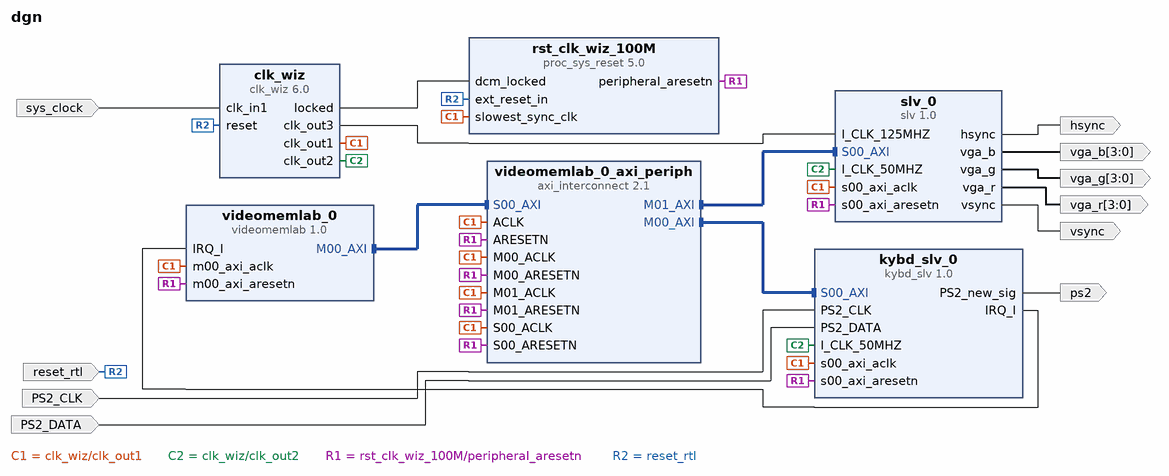
[diagram p0: block diagram of the top level]
# Vivado block design dgn, xc7z010clg400-1, Vivado 2019.2
create_bd_design dgn

create_bd_port -dir O vsync
create_bd_port -dir O hsync
create_bd_port -dir O -from 3 -to 0 vga_r
create_bd_port -dir O -from 3 -to 0 vga_g
create_bd_port -dir O -from 3 -to 0 vga_b
create_bd_port -dir O ps2
create_bd_port -dir I PS2_CLK
create_bd_port -dir I PS2_DATA
create_bd_port -dir I -type clk sys_clock
set_property -dict {CONFIG.FREQ_HZ 125000000} [get_bd_ports sys_clock]
create_bd_port -dir I -type rst reset_rtl
set_property -dict {CONFIG.POLARITY ACTIVE_HIGH} [get_bd_ports reset_rtl]

create_bd_cell -type ip -vlnv clarkson.edu:user:slv:1.0 slv_0
create_bd_cell -type ip -vlnv xilinx.com:ip:clk_wiz:6.0 clk_wiz
set_property -dict [list \
  CONFIG.CLKIN1_JITTER_PS 80.0 \
  CONFIG.CLKOUT1_JITTER 124.615 \
  CONFIG.CLKOUT1_PHASE_ERROR 96.948 \
  CONFIG.CLKOUT2_JITTER 143.688 \
  CONFIG.CLKOUT2_PHASE_ERROR 96.948 \
  CONFIG.CLKOUT2_REQUESTED_OUT_FREQ 50.000 \
  CONFIG.CLKOUT2_USED true \
  CONFIG.CLKOUT3_JITTER 119.348 \
  CONFIG.CLKOUT3_PHASE_ERROR 96.948 \
  CONFIG.CLKOUT3_REQUESTED_OUT_FREQ 125.000 \
  CONFIG.CLKOUT3_USED true \
  CONFIG.MMCM_CLKFBOUT_MULT_F 8.000 \
  CONFIG.MMCM_CLKIN1_PERIOD 8.000 \
  CONFIG.MMCM_CLKOUT1_DIVIDE 20 \
  CONFIG.MMCM_CLKOUT2_DIVIDE 8 \
  CONFIG.NUM_OUT_CLKS 3 \
  CONFIG.PRIM_IN_FREQ 125.000 \
] [get_bd_cells clk_wiz]
create_bd_cell -type ip -vlnv xilinx.com:ip:axi_interconnect:2.1 videomemlab_0_axi_periph
set_property -dict {CONFIG.NUM_MI 2} [get_bd_cells videomemlab_0_axi_periph]
create_bd_cell -type ip -vlnv xilinx.com:ip:proc_sys_reset:5.0 rst_clk_wiz_100M
set_property -dict {CONFIG.C_EXT_RST_WIDTH 1} [get_bd_cells rst_clk_wiz_100M]
create_bd_cell -type ip -vlnv clarkson.edu:user:kybd_slv:1.0 kybd_slv_0
create_bd_cell -type ip -vlnv clarkson.edu:user:videomemlab:1.0 videomemlab_0

# ---- connections ----

connect_bd_intf_net [get_bd_intf_pins videomemlab_0/M00_AXI] [get_bd_intf_pins videomemlab_0_axi_periph/S00_AXI]
connect_bd_intf_net [get_bd_intf_pins videomemlab_0_axi_periph/M00_AXI] [get_bd_intf_pins kybd_slv_0/S00_AXI]
connect_bd_intf_net [get_bd_intf_pins videomemlab_0_axi_periph/M01_AXI] [get_bd_intf_pins slv_0/S00_AXI]
connect_bd_net [get_bd_pins kybd_slv_0/PS2_new_sig] [get_bd_ports ps2]
connect_bd_net [get_bd_pins kybd_slv_0/IRQ_I] [get_bd_pins videomemlab_0/IRQ_I]
connect_bd_net [get_bd_pins clk_wiz/clk_out1] \
  [get_bd_pins slv_0/s00_axi_aclk] [get_bd_pins videomemlab_0_axi_periph/ACLK] \
  [get_bd_pins videomemlab_0_axi_periph/S00_ACLK] [get_bd_pins rst_clk_wiz_100M/slowest_sync_clk] \
  [get_bd_pins videomemlab_0_axi_periph/M00_ACLK] [get_bd_pins videomemlab_0_axi_periph/M01_ACLK] \
  [get_bd_pins kybd_slv_0/s00_axi_aclk] [get_bd_pins videomemlab_0/m00_axi_aclk]
connect_bd_net [get_bd_ports sys_clock] [get_bd_pins clk_wiz/clk_in1]
connect_bd_net [get_bd_pins clk_wiz/clk_out2] [get_bd_pins slv_0/I_CLK_50MHZ] [get_bd_pins kybd_slv_0/I_CLK_50MHZ]
connect_bd_net [get_bd_pins clk_wiz/clk_out3] [get_bd_pins slv_0/I_CLK_125MHZ]
connect_bd_net [get_bd_pins slv_0/hsync] [get_bd_ports hsync]
connect_bd_net [get_bd_pins slv_0/vsync] [get_bd_ports vsync]
connect_bd_net [get_bd_ports PS2_CLK] [get_bd_pins kybd_slv_0/PS2_CLK]
connect_bd_net [get_bd_ports PS2_DATA] [get_bd_pins kybd_slv_0/PS2_DATA]
connect_bd_net [get_bd_pins slv_0/vga_g] [get_bd_ports vga_g]
connect_bd_net [get_bd_pins slv_0/vga_b] [get_bd_ports vga_b]
connect_bd_net [get_bd_pins slv_0/vga_r] [get_bd_ports vga_r]
connect_bd_net [get_bd_pins clk_wiz/locked] [get_bd_pins rst_clk_wiz_100M/dcm_locked]
connect_bd_net [get_bd_pins rst_clk_wiz_100M/peripheral_aresetn] \
  [get_bd_pins slv_0/s00_axi_aresetn] [get_bd_pins videomemlab_0_axi_periph/S00_ARESETN] \
  [get_bd_pins videomemlab_0_axi_periph/M00_ARESETN] [get_bd_pins videomemlab_0_axi_periph/ARESETN] \
  [get_bd_pins videomemlab_0_axi_periph/M01_ARESETN] [get_bd_pins kybd_slv_0/s00_axi_aresetn] \
  [get_bd_pins videomemlab_0/m00_axi_aresetn]
connect_bd_net [get_bd_ports reset_rtl] [get_bd_pins clk_wiz/reset] [get_bd_pins rst_clk_wiz_100M/ext_reset_in]

# ---- address map ----
assign_bd_address -offset 0x40000000 -range 64K -target_address_space [get_bd_addr_spaces videomemlab_0/M00_AXI] [get_bd_addr_segs slv_0/S00_AXI/S00_AXI_reg]
assign_bd_address -offset 0x80000000 -range 64K -target_address_space [get_bd_addr_spaces videomemlab_0/M00_AXI] [get_bd_addr_segs kybd_slv_0/S00_AXI/S00_AXI_reg]

validate_bd_design
save_bd_design
